# Altium schematic sheet Buzzer piezo PB1475.SchDoc
size 209 x 297 mm; Scale: 1:1; Letter1Column: Э
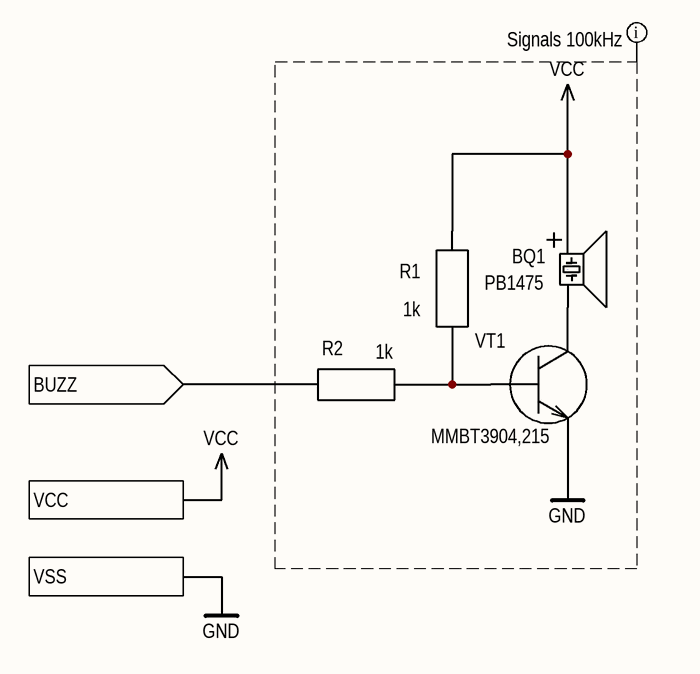
[diagram p0: Buzzer piezo PB1475.SchDoc]

## Parts
BQ1  PB1475  [BUZ-D14x7.5N]
R1  1k  [RESC2012N]
R2  1k  [RESC2012N]
VT1  MMBT3904,215  [SOT-23-3N]

## Ports
BUZZ (in), VCC, VSS

## Nets
GND: VT1.2(Emitter) ; port VSS
VCC: BQ1.1(+) R1.1 ; port VCC
BUZZ: R2.1 ; port BUZZ
NetBQ1_2: BQ1.2(-) VT1.3(Collector)
NetR1_2: R1.2 R2.2 VT1.1(Base)

## Layout directives
net class Signals 100kHz; rule Width Constraint [Pref Width = 0.25mm    Min Width = 0.1mm    Max Width = 0.5mm]; rule Clearance Constraint [Clearance = 0.2mm]; rule Routing Via Style [Pref Size = 1.1mm    Pref Hole Size = 0.5mm]: GND, VCC

## Notes on the sheet
- Перв. примен.
- Справ. №
- Подп. и дата
- Инв. № дубл.
- Взам. инв. №
- Разраб.
- Изм.
- Лист
- № докум.
- Подп.
- Дата
- Лит.
- Масса
- Масштаб
- Пров.
- Т.контр.
- Листов
- Инв. № подл.
- Утв.
- Н.контр.
- 2.106-A4
- Копировал
- Формат А4

## Library data of the parts
BQ1 = PB1475: Buzzer d14x7.5 TH; Manufacturer: SWT; Component: Audio Buzzer; Group: Signal; Voltage supply: 1V - 30V; Frequency: 4kHz; Current supply: 2mA; Mode: Single tone; Package: D14x7.5; Part name: PB1475; Operating temperature: -20°C +70°C; Mounting type: Through hole; Dimension: 14.00mm x 14.00mm; Height: 7.70mm; Technology: Piezo
R1 R2 = RC0805JR-071KL: RESC 1k 0805(2012); Manufacturer: Yageo; Group: Discrete; Temperature coefficient: ±100ppm/°C; Tolerance: ±5%; Power: 0.125W; Component: Resistor Ceramic; Part name: RC0805JR-071KL; Type: Thin film; Package: 0805 (2012); Value: 1k; Dimension: 2.00mm x 1.25mm; Height: 0.60mm; Operating temperature: -55°C +155°C; Mounting type: Surface mount
VT1 = MMBT3904,215: BJT NPN 0.2A 40V; Manufacturer: NXP Semiconductors; Group: Discrete; Emiter-base voltage: 6V; Collector current: 200mA; Power: 250mW; Component: Transistor BJT; Part name: MMBT3904,215; Package: SOT-23-3; Collector-emiter voltage: 40V; BJT type: NPN; Dimension: 3.00mm x 2.50mm; Height: 1.10mm; Operating temperature: -65°C +150°C; Mounting type: Surface mount